# Altium schematic sheet IMX8_INTERFACE.SchDoc
size 594 x 420 mm; SheetNumber: 4; SheetTotal: 20
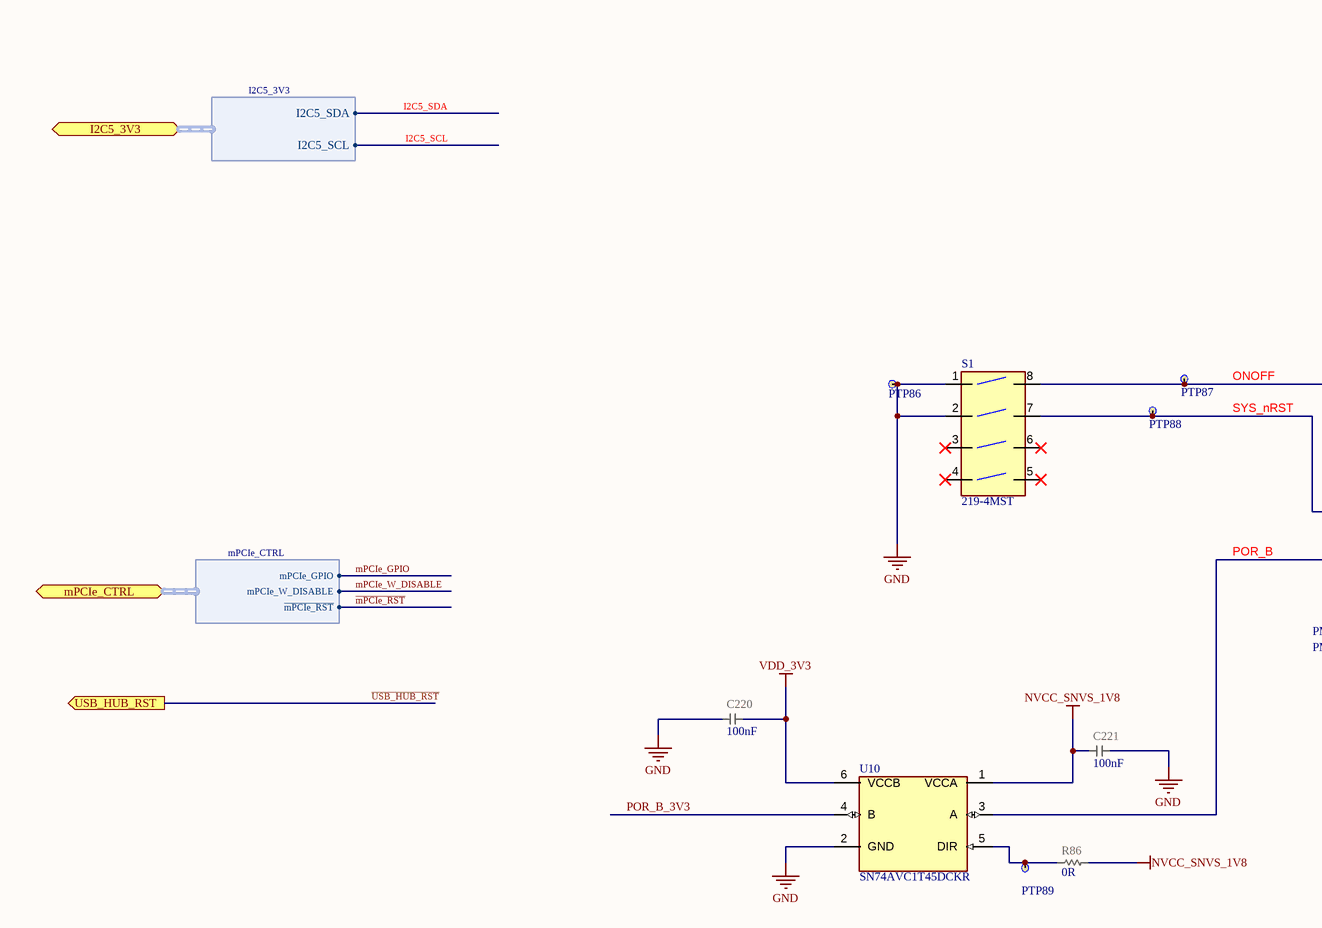
[diagram p0: IMX8_INTERFACE.SchDoc, top left]
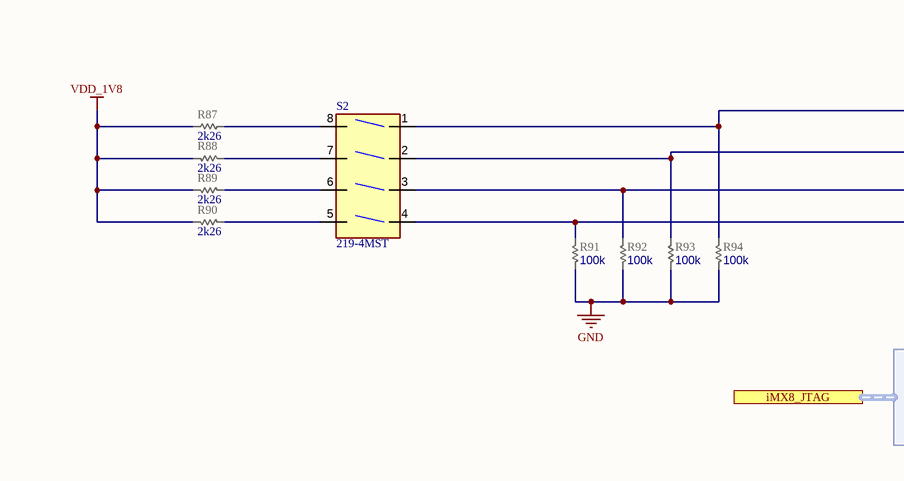
[diagram p1: IMX8_INTERFACE.SchDoc, bottom left]
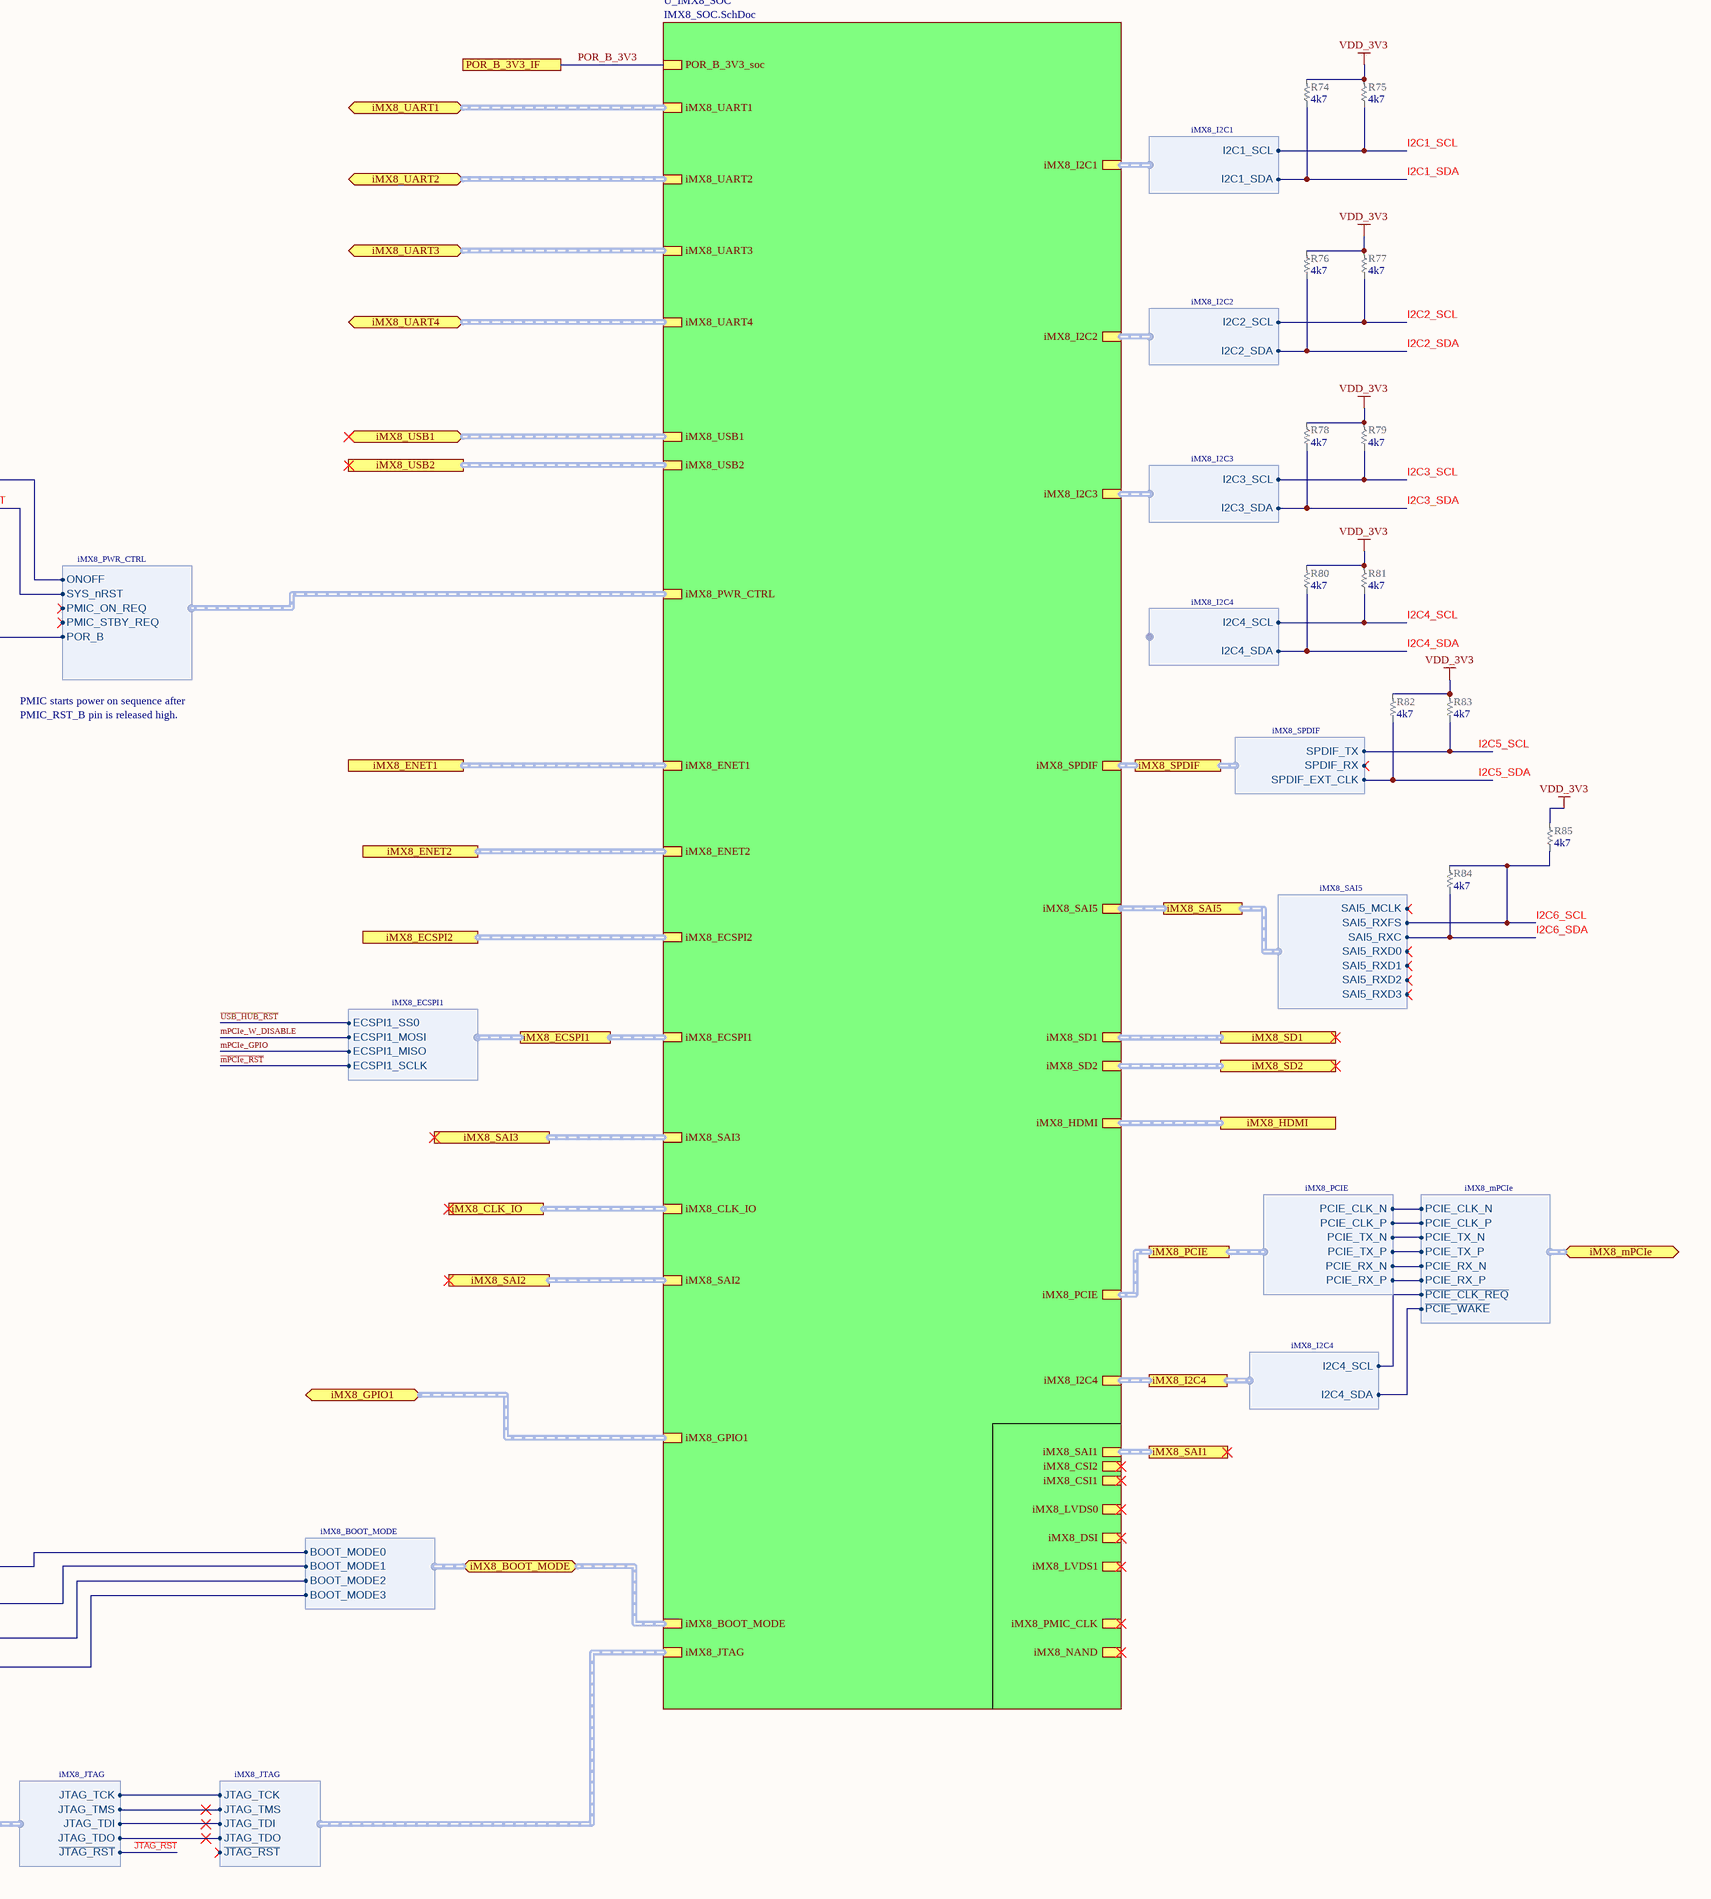
[diagram p2: IMX8_INTERFACE.SchDoc, bottom right]

## Parts
C220  value 100nF  [CAP_0201_UN1Q]  (hidden comment: CAP_0201_100n_X7S_16V)
C221  value 100nF  [CAP_0201_UN1Q]  (hidden comment: CAP_0201_100n_X7S_16V)
PTP86  PTP_0.4mm  [PTP_0.4mm]  (value not drawn)  (no BOM)
PTP87  PTP_0.4mm  [PTP_0.4mm]  (value not drawn)  (no BOM)
PTP88  PTP_0.4mm  [PTP_0.4mm]  (value not drawn)  (no BOM)
PTP89  PTP_0.4mm  [PTP_0.4mm]  (value not drawn)  (no BOM)
R74  value 4k7  [RES_0201_UN1Q]  (hidden comment: RES_0201_4k7)
R75  value 4k7  [RES_0201_UN1Q]  (hidden comment: RES_0201_4k7)
R76  value 4k7  [RES_0201_UN1Q]  (hidden comment: RES_0201_4k7)
R77  value 4k7  [RES_0201_UN1Q]  (hidden comment: RES_0201_4k7)
R78  value 4k7  [RES_0201_UN1Q]  (hidden comment: RES_0201_4k7)
R79  value 4k7  [RES_0201_UN1Q]  (hidden comment: RES_0201_4k7)
R80  value 4k7  [RES_0201_UN1Q]  (hidden comment: RES_0201_4k7)
R81  value 4k7  [RES_0201_UN1Q]  (hidden comment: RES_0201_4k7)
R82  value 4k7  [RES_0201_UN1Q]  (hidden comment: RES_0201_4k7)
R83  value 4k7  [RES_0201_UN1Q]  (hidden comment: RES_0201_4k7)
R84  value 4k7  [RES_0201_UN1Q]  (hidden comment: RES_0201_4k7)
R85  value 4k7  [RES_0201_UN1Q]  (hidden comment: RES_0201_4k7)
R86  value 0R  [RES_0201_UN1Q]  (hidden comment: RES_0201_0R)
R87  value 2k26  [RES_0201_UN1Q]  (hidden comment: RES_0201_2k26)
R88  value 2k26  [RES_0201_UN1Q]  (hidden comment: RES_0201_2k26)
R89  value 2k26  [RES_0201_UN1Q]  (hidden comment: RES_0201_2k26)
R90  value 2k26  [RES_0201_UN1Q]  (hidden comment: RES_0201_2k26)
R91  value 100k  [RES_0201_UN1Q]  (hidden comment: RES_0201_100k)
R92  value 100k  [RES_0201_UN1Q]  (hidden comment: RES_0201_100k)
R93  value 100k  [RES_0201_UN1Q]  (hidden comment: RES_0201_100k)
R94  value 100k  [RES_0201_UN1Q]  (hidden comment: RES_0201_100k)
S1  219-4MST  [SW_219-4MST]
S2  219-4MST  [SW_219-4MST]
U10  SN74AVC1T45DCKR  [SOT65P210X110-6N]

## Sub-sheets
U_IMX8_SOC = IMX8_SOC.SchDoc: iMX8_USB1 (harness iMX8_USB1), iMX8_USB2 (harness iMX8_USB2), iMX8_SD1 (harness iMX8_SD1), iMX8_SD2 (harness iMX8_SD2), iMX8_NAND (harness iMX8_PCIE), iMX8_PCIE (harness iMX8_PCIE), iMX8_DSI (harness iMX8_DSI), iMX8_LVDS0 (harness iMX8_LVDS0), iMX8_LVDS1 (harness iMX8_LVDS1), iMX8_CSI1 (harness iMX8_CSI1), iMX8_CSI2 (harness iMX8_CSI2), iMX8_HDMI (harness iMX8_HDMI), iMX8_UART1 (harness iMX8_UART1), iMX8_UART2 (harness iMX8_UART2), iMX8_UART3 (harness iMX8_UART3), iMX8_UART4 (harness iMX8_UART4), iMX8_I2C1 (harness iMX8_I2C1), iMX8_I2C2 (harness iMX8_I2C2), iMX8_I2C3 (harness iMX8_I2C3), iMX8_SAI1 (harness iMX8_SAI1), iMX8_SAI2 (harness iMX8_SAI2), iMX8_SAI5 (harness iMX8_SAI5), iMX8_SAI3 (harness iMX8_SAI3), iMX8_ENET1, iMX8_ENET2 (harness iMX8_ENET), iMX8_ECSPI2 (harness iMX8_ECSPI2), iMX8_GPIO1 (harness iMX8_GPIO1), iMX8_SPDIF (harness iMX8_SPDIF), iMX8_BOOT_MODE (harness iMX8_BOOT_MODE), iMX8_JTAG (harness iMX8_JTAG), iMX8_PMIC_CLK (harness iMX8_PMIC_CLK), iMX8_PWR_CTRL (harness iMX8_PWR_CTRL), iMX8_I2C4 (harness iMX8_I2C4), iMX8_ECSPI1 (harness iMX8_ECSPI1), POR_B_3V3_soc, iMX8_CLK_IO (harness iMX8_CLK_IO_sub)

## Ports
I2C5_3V3 (bidir, harness I2C5_3V3), iMX8_BOOT_MODE (bidir, harness iMX8_BOOT_MODE), iMX8_CLK_IO (harness iMX8_CLK_IO_sub), iMX8_ECSPI1 (harness iMX8_ECSPI1), iMX8_ECSPI2 (harness iMX8_ECSPI2), iMX8_ENET1, iMX8_ENET2 (harness iMX8_ENET), iMX8_GPIO1 (bidir, harness iMX8_GPIO1), iMX8_HDMI (harness iMX8_HDMI), iMX8_I2C4 (harness iMX8_I2C4), iMX8_JTAG (harness iMX8_JTAG), iMX8_mPCIe (bidir, harness iMX8_mPCIe), iMX8_PCIE (harness iMX8_PCIE), iMX8_SAI1 (harness iMX8_SAI1), iMX8_SAI2 (harness iMX8_SAI2), iMX8_SAI3 (harness iMX8_SAI3), iMX8_SAI5 (harness iMX8_SAI5), iMX8_SD1 (harness iMX8_SD1), iMX8_SD2 (harness iMX8_SD2), iMX8_SPDIF (harness iMX8_SPDIF), iMX8_UART1 (bidir, harness iMX8_UART1), iMX8_UART2 (bidir, harness iMX8_UART2), iMX8_UART3 (bidir, harness iMX8_UART3), iMX8_UART4 (bidir, harness iMX8_UART4), iMX8_USB1 (bidir, harness iMX8_USB1), iMX8_USB2 (harness iMX8_USB2), mPCIe_CTRL (bidir, harness mPCIe_CTRL), POR_B_3V3_IF, USB_HUB_RST (out)

## Harnesses
iMX8_JTAG: JTAG_TCK, JTAG_TMS, JTAG_TDI, JTAG_TDO, ~{JTAG_RST}
iMX8_PWR_CTRL: ONOFF, POR_B, PMIC_ON_REQ, PMIC_STBY_REQ, SYS_nRST
iMX8_BOOT_MODE: BOOT_MODE0, BOOT_MODE1, BOOT_MODE2, BOOT_MODE3
iMX8_I2C1: I2C1_SCL, I2C1_SDA
iMX8_I2C2: I2C2_SCL, I2C2_SDA
iMX8_I2C3: I2C3_SCL, I2C3_SDA
iMX8_I2C4: I2C4_SCL, I2C4_SDA
iMX8_SAI5: SAI5_MCLK, SAI5_RXFS, SAI5_RXC, SAI5_RXD0, SAI5_RXD1, SAI5_RXD2, SAI5_RXD3
iMX8_SPDIF: SPDIF_TX, SPDIF_RX, SPDIF_EXT_CLK
I2C5_3V3: I2C5_SDA, I2C5_SCL
iMX8_PCIE: PCIE_CLK_N, PCIE_CLK_P, PCIE_TX_N, PCIE_TX_P, PCIE_RX_N, PCIE_RX_P
iMX8_mPCIe: PCIE_CLK_N, PCIE_CLK_P, PCIE_TX_N, PCIE_TX_P, PCIE_RX_N, PCIE_RX_P, ~{PCIE_CLK_REQ}, ~{PCIE_WAKE}
mPCIe_CTRL: mPCIe_GPIO, ~{mPCIe_RST}, mPCIe_W_DISABLE
iMX8_ECSPI1: ECSPI1_SS0, ECSPI1_MOSI, ECSPI1_MISO, ECSPI1_SCLK

## Nets
GND: C220.1 C221.2 PTP86.1(TP) R91.1 R92.1 R93.1 R94.1 S1.1 S1.2 U10.2(GND)
NVCC_SNVS_1V8: C221.1 R86.2 U10.1(VCCA)
VDD_1V8: R87.1 R88.1 R89.1 R90.1
VDD_3V3: C220.2 R74.2 R75.2 R76.2 R77.2 R78.2 R79.2 R80.2 R81.2 R82.2 R83.2 R85.2 U10.6(VCCB)
~{JTAG_RST}: port iMX8_JTAG.~{JTAG_RST}
~{mPCIe_RST}: port mPCIe_CTRL.~{mPCIe_RST}, port iMX8_ECSPI1.ECSPI1_SCLK
~{USB_HUB_RST}: port USB_HUB_RST, port iMX8_ECSPI1.ECSPI1_SS0
I2C1_SCL: R75.1 ; sheet U_IMX8_SOC/iMX8_I2C1.I2C1_SCL
I2C1_SDA: R74.1 ; sheet U_IMX8_SOC/iMX8_I2C1.I2C1_SDA
I2C2_SCL: R77.1 ; sheet U_IMX8_SOC/iMX8_I2C2.I2C2_SCL
I2C2_SDA: R76.1 ; sheet U_IMX8_SOC/iMX8_I2C2.I2C2_SDA
I2C3_SCL: R79.1 ; sheet U_IMX8_SOC/iMX8_I2C3.I2C3_SCL
I2C3_SDA: R78.1 ; sheet U_IMX8_SOC/iMX8_I2C3.I2C3_SDA
I2C4_SCL: R81.1 ; harness iMX8_I2C4.I2C4_SCL
I2C4_SDA: R80.1 ; harness iMX8_I2C4.I2C4_SDA
I2C5_SCL: R83.1 ; port iMX8_SPDIF.SPDIF_TX, port I2C5_3V3.I2C5_SCL
I2C5_SDA: R82.1 ; port iMX8_SPDIF.SPDIF_EXT_CLK, port I2C5_3V3.I2C5_SDA
I2C6_SCL: R84.2 R85.1 ; port iMX8_SAI5.SAI5_RXFS
I2C6_SDA: R84.1 ; port iMX8_SAI5.SAI5_RXC
mPCIe_GPIO: port mPCIe_CTRL.mPCIe_GPIO, port iMX8_ECSPI1.ECSPI1_MISO
mPCIe_W_DISABLE: port mPCIe_CTRL.mPCIe_W_DISABLE, port iMX8_ECSPI1.ECSPI1_MOSI
ONOFF: PTP87.1(TP) S1.8 ; sheet U_IMX8_SOC/iMX8_PWR_CTRL.ONOFF
POR_B: U10.3(A) ; sheet U_IMX8_SOC/iMX8_PWR_CTRL.POR_B
POR_B_3V3: U10.4(B) ; port POR_B_3V3_IF, sheet U_IMX8_SOC/POR_B_3V3_soc
SYS_nRST: PTP88.1(TP) S1.7 ; sheet U_IMX8_SOC/iMX8_PWR_CTRL.SYS_nRST
NetPTP89_1: PTP89.1(TP) R86.1 U10.5(DIR)
NetR87_2: R87.2 S2.8
NetR88_2: R88.2 S2.7
NetR89_2: R89.2 S2.6
NetR90_2: R90.2 S2.5
NetR91_2: R91.2 S2.4 ; port iMX8_BOOT_MODE.BOOT_MODE3
NetR92_2: R92.2 S2.3 ; port iMX8_BOOT_MODE.BOOT_MODE2
NetR93_2: R93.2 S2.2 ; port iMX8_BOOT_MODE.BOOT_MODE1
NetR94_2: R94.2 S2.1 ; port iMX8_BOOT_MODE.BOOT_MODE0
(unnamed): port iMX8_JTAG.JTAG_TCK, sheet U_IMX8_SOC/iMX8_JTAG.JTAG_TCK
(unnamed): port iMX8_JTAG.JTAG_TMS, sheet U_IMX8_SOC/iMX8_JTAG.JTAG_TMS
(unnamed): port iMX8_JTAG.JTAG_TDI, sheet U_IMX8_SOC/iMX8_JTAG.JTAG_TDI
(unnamed): port iMX8_JTAG.JTAG_TDO, sheet U_IMX8_SOC/iMX8_JTAG.JTAG_TDO
(unnamed): port iMX8_I2C4.I2C4_SCL, port iMX8_mPCIe.~{PCIE_CLK_REQ}
(unnamed): port iMX8_I2C4.I2C4_SDA, port iMX8_mPCIe.~{PCIE_WAKE}
(unnamed): port iMX8_PCIE.PCIE_CLK_N, port iMX8_mPCIe.PCIE_CLK_N
(unnamed): port iMX8_PCIE.PCIE_CLK_P, port iMX8_mPCIe.PCIE_CLK_P
(unnamed): port iMX8_PCIE.PCIE_TX_N, port iMX8_mPCIe.PCIE_TX_N
(unnamed): port iMX8_PCIE.PCIE_TX_P, port iMX8_mPCIe.PCIE_TX_P
(unnamed): port iMX8_PCIE.PCIE_RX_N, port iMX8_mPCIe.PCIE_RX_N
(unnamed): port iMX8_PCIE.PCIE_RX_P, port iMX8_mPCIe.PCIE_RX_P

Not connected (* = marked no-connect by the designer): S1 3* 4* 5* 6*

## Buses and harness runs
harness port iMX8_BOOT_MODE = sheet U_IMX8_SOC/iMX8_BOOT_MODE
harness port iMX8_CLK_IO = sheet U_IMX8_SOC/iMX8_CLK_IO
harness port iMX8_ECSPI1 = sheet U_IMX8_SOC/iMX8_ECSPI1
harness port iMX8_ECSPI2 = sheet U_IMX8_SOC/iMX8_ECSPI2
harness port iMX8_ENET1 = sheet U_IMX8_SOC/iMX8_ENET1
harness port iMX8_ENET2 = sheet U_IMX8_SOC/iMX8_ENET2
harness port iMX8_GPIO1 = sheet U_IMX8_SOC/iMX8_GPIO1
harness port iMX8_HDMI = sheet U_IMX8_SOC/iMX8_HDMI
harness port iMX8_I2C4 = sheet U_IMX8_SOC/iMX8_I2C4
harness port iMX8_PCIE = sheet U_IMX8_SOC/iMX8_PCIE
harness port iMX8_SAI1 = sheet U_IMX8_SOC/iMX8_SAI1
harness port iMX8_SAI2 = sheet U_IMX8_SOC/iMX8_SAI2
harness port iMX8_SAI3 = sheet U_IMX8_SOC/iMX8_SAI3
harness port iMX8_SAI5 = sheet U_IMX8_SOC/iMX8_SAI5
harness port iMX8_SD1 = sheet U_IMX8_SOC/iMX8_SD1
harness port iMX8_SD2 = sheet U_IMX8_SOC/iMX8_SD2
harness port iMX8_SPDIF = sheet U_IMX8_SOC/iMX8_SPDIF
harness port iMX8_UART1 = sheet U_IMX8_SOC/iMX8_UART1
harness port iMX8_UART2 = sheet U_IMX8_SOC/iMX8_UART2
harness port iMX8_UART3 = sheet U_IMX8_SOC/iMX8_UART3
harness port iMX8_UART4 = sheet U_IMX8_SOC/iMX8_UART4
harness port iMX8_USB1 = sheet U_IMX8_SOC/iMX8_USB1
harness port iMX8_USB2 = sheet U_IMX8_SOC/iMX8_USB2

## Notes on the sheet
- PMIC_RST_B pin is released high.
- PMIC starts power on sequence after
- DWG NO:
- REV:
- THIS DOCUMENT AND THE DATA DISCLOSED HEREIN OR
- HEREWITH IS THE PROPERTY OF ALTIUM LIMITED AND MAY
- BE FREELY DISTRIBUTED IN WHOLE. NO RIGHTS ARE
- RESERVED OR EXPRESS OR IMPLIED WARANTEE GIVEN.
- REVISION
- DESCRIPTION
- DATE
- APPROVED
- ENG:
- APPROVALS
- PROJECT
- DSN:
- CHK:
- REFERENCE DOCUMENTS
- PROJECT REVISION:
- TITLE
- DOCUMENT REVISION:
- DESIGN ITEM:
- BOM:
- FAB DWG:
- PCB DWG:
- ASSY DWG:
- SCALE:
- A2
- SIZE
- CAGE CODE
- FILE NAME
- DWG NO.
- SHEET
- OF
- REV

## Library data of the parts
C220 C221 = CMP-001-000385-16: CAP; Part Number: GRM033C71C104KE14D; Manufacturer: Murata; Temperature characteristics: X7S; Tolerance: +/-10%; Sort order: 302; HasBeenBuilt: TBD; Alternative component: Allowed; Voltage: 16V; System: RLC; Package: 0201; ClassName: SMALL; ComponentLink1Description: 1_Datasheet; ComponentLink2Description: 2_Product page; ComponentLink3Description: 3_X-information; ComponentLink4Description: 4_X-information; Creation date: 20190101; Source: RLC_UN1Q.SchLib; Manufacturer Part Number: GRM033C71C104KE14D; Component Type: Capacitor
PTP86-PTP89 = CMP-001-001296-3: Production Testpoint 0.4mm. Flying probe. Use 1mm pitch.; Part Number: PTP 0.4mm; ComponentLink4Description: 4_X-information; ComponentLink1Description: 1_Datasheet; Sort order: -; ClassName: SMALL; System: Test Point; HasBeenBuilt: -; Design Item ID: PTP_0.4mm; ComponentLink3Description: 3_X-information; Creation date: 20240909; ComponentLink2Description: 2_Product page; Component Type: Test Point
R74-R85 = CMP-001-000475-13: RES; Part Number: RC0201FR-074K7L; Manufacturer: YAGEO; Manufacturer: Yageo Group; Power Rating: 1/20W; Sort order: 322; HasBeenBuilt: TBD; Alternative component: Allowed; Tolerance: 1%; System: RLC; Package: 0201; ClassName: SMALL; ComponentLink1Description: 1_Datasheet; ComponentLink2Description: 2_Product page; ComponentLink3Description: 3_X-information; ComponentLink4Description: 4_X-information; Creation date: 20190101; Source: RLC_UN1Q.SchLib; Manufacturer Part Number: RC0201FR-074K7L; Component Type: Resistor
R86 = CMP-001-000429-13: RES; Part Number: RC0201JR-070RL; Manufacturer: YAGEO; Manufacturer: Yageo Group; Tolerance: 5%; Sort order: 322; HasBeenBuilt: TBD; Alternative component: Allowed; System: RLC; Power Rating: 1/20W; Package: 0201; ComponentLink1Description: 1_Datasheet; ComponentLink2Description: 2_Product page; ComponentLink3Description: 3_X-information; ComponentLink4Description: 4_X-information; Creation date: 20190101; ClassName: SMALL; Source: RLC_UN1Q.SchLib; Manufacturer Part Number: RC0201JR-070RL; Component Type: Resistor
R87-R90 = CMP-001-001013-2: RES; Manufacturer: YAGEO; Part Number: RC0201FR-072K26L; Power Rating: 1/20W; Tolerance: 1%; Sort order: 322; Alternative component: Allowed; HasBeenBuilt: TBD; System: RLC; ComponentLink4Description: 4_X-information; ComponentLink1Description: 1_Datasheet; Package: 0201; ComponentLink2Description: 2_Product page; Creation date: 20250117; Source: RLC_UN1Q.SchLib; ComponentLink3Description: 3_X-information; ClassName: SMALL; Component Type: Resistor
R91-R94 = CMP-001-000526-11: RES; Part Number: RC0201FR-07100KL; Manufacturer: YAGEO; Manufacturer: Yageo Group; Tolerance: 1%; Power Rating: 1/20W; Sort order: 322; HasBeenBuilt: TBD; Alternative component: Allowed; System: RLC; Package: 0201; ClassName: SMALL; ComponentLink1Description: 1_Datasheet; ComponentLink2Description: 2_Product page; ComponentLink3Description: 3_X-information; ComponentLink4Description: 4_X-information; Creation date: 20190101; Source: RLC_UN1Q.SchLib; Manufacturer Part Number: RC0201FR-07100KL; Component Type: Resistor
S1 S2 = 219-4MST: Dip Switch SPST 4 Position Surface Mount Slide (Standard) Actuator 100mA 20VDC; MF: CTS Electrocomponents; SnapEDA_Link: https://www.snapeda.com/parts/219-4MST/CTS+Components/view-part/?ref=snap; Package: None; Value: *; MP: 219-4MST; Check_prices: https://www.snapeda.com/parts/219-4MST/CTS+Components/view-part/?ref=eda
U10 = SN74AVC1T45DCKR: Single-Bit Dual-Supply Bus Transceiver with Configurable Voltage-Level Shifting and 3-State Outputs; MF: Texas Instruments; SnapEDA_Link: https://www.snapeda.com/parts/SN74AVC1T45DCKR/Texas+Instruments/view-part/?ref=snap; Package: SOT-SC70-6 Texas Instruments; Value: *; MP: SN74AVC1T45DCKR; Check_prices: https://www.snapeda.com/parts/SN74AVC1T45DCKR/Texas+Instruments/view-part/?ref=eda